# Altium schematic sheet 2403_NUCLEO64.SchDoc: STM32 NUCLEO64
size A4; Organization: R.LAB; DocumentNumber: 2403; Revision: 1; SheetNumber: 2; SheetTotal: 3
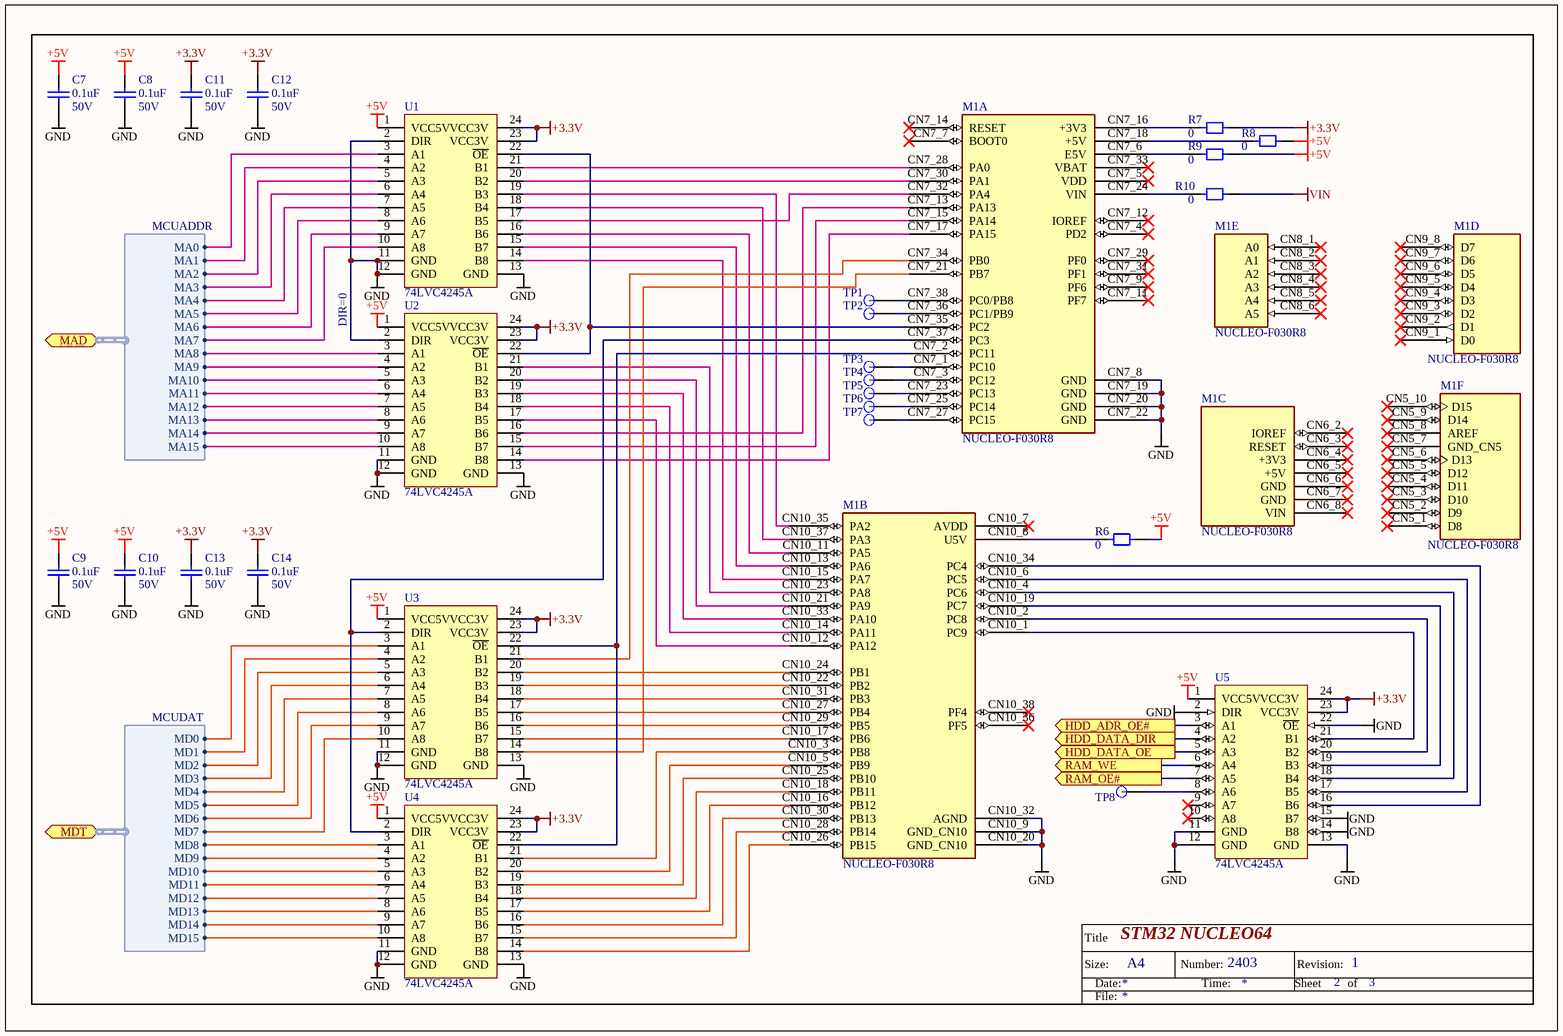
[diagram p0: 2403_NUCLEO64.SchDoc]

## Parts
C7  0.1uF  Rated Voltage: 50V  [0805_CAPC2013X100N]
C8  0.1uF  Rated Voltage: 50V  [0805_CAPC2013X100N]
C9  0.1uF  Rated Voltage: 50V  [0805_CAPC2013X100N]
C10  0.1uF  Rated Voltage: 50V  [0805_CAPC2013X100N]
C11  0.1uF  Rated Voltage: 50V  [0805_CAPC2013X100N]
C12  0.1uF  Rated Voltage: 50V  [0805_CAPC2013X100N]
C13  0.1uF  Rated Voltage: 50V  [0805_CAPC2013X100N]
C14  0.1uF  Rated Voltage: 50V  [0805_CAPC2013X100N]
M1  NUCLEO-F030R8  [MODULE_NUCLEO-F030R8]  (parts A,B,C,D,E,F of 6)
R6  0  [0805_RESC2013X84N]
R7  0  [0805_RESC2013X84N]
R8  0  [0805_RESC2013X84N]
R9  0  [0805_RESC2013X84N]
R10  0  [0805_RESC2013X84N]
TP1  TEST_POINT  [TEST2]  (value not drawn)
TP2  TEST_POINT  [TEST2]  (value not drawn)
TP3  TEST_POINT  [TEST2]  (value not drawn)
TP4  TEST_POINT  [TEST2]  (value not drawn)
TP5  TEST_POINT  [TEST2]  (value not drawn)
TP6  TEST_POINT  [TEST2]  (value not drawn)
TP7  TEST_POINT  [TEST2]  (value not drawn)
TP8  TEST_POINT  [TEST2]  (value not drawn)
U1  74LVC4245A  [SOIC127P1032X265-24N]
U2  74LVC4245A  [SOIC127P1032X265-24N]
U3  74LVC4245A  [SOIC127P1032X265-24N]
U4  74LVC4245A  [SOIC127P1032X265-24N]
U5  74LVC4245A  [SOIC127P1032X265-24N]

## Ports
HDD_ADR_OE# (out), HDD_DATA_DIR (out), HDD_DATA_OE (out), MAD (harness MCUADDR), MDT (harness MCUDAT), RAM_OE# (out), RAM_WE (out)

## Harnesses
MCUADDR: MA0, MA1, MA2, MA3, MA4, MA5, MA6, MA7, MA8, MA9, MA10, MA11, MA12, MA13, MA14, MA15
MCUDAT: MD0, MD1, MD2, MD3, MD4, MD5, MD6, MD7, MD8, MD9, MD10, MD11, MD12, MD13, MD14, MD15

## Nets
+3.3V: C11.2 C12.2 C13.2 C14.2 R7.2 U1.23(VCC3V) U1.24(VCC3V) U2.23(VCC3V) U2.24(VCC3V) U3.23(VCC3V) U3.24(VCC3V) U4.23(VCC3V) U4.24(VCC3V) U5.23(VCC3V) U5.24(VCC3V)
+5V: C7.2 C8.2 C9.2 C10.2 R6.2 R8.2 R9.2 U1.1(VCC5V) U2.1(VCC5V) U3.1(VCC5V) U4.1(VCC5V) U5.1(VCC5V)
GND: C7.1 C8.1 C9.1 C10.1 C11.1 C12.1 C13.1 C14.1 M1.CN7_8(GND) M1.CN7_19(GND) M1.CN7_20(GND) M1.CN7_22(GND) M1.CN10_9(GND_CN10) M1.CN10_20(GND_CN10) M1.CN10_32(AGND) U1.2(DIR) U1.11(GND) U1.12(GND) U1.13(GND) U2.2(DIR) U2.11(GND) U2.12(GND) U2.13(GND) U3.11(GND) U3.12(GND) U3.13(GND) U4.11(GND) U4.12(GND) U4.13(GND) U5.2(DIR) U5.11(GND) U5.12(GND) U5.13(GND) U5.14(B8) U5.15(B7) U5.22(~{OE})
VIN: R10.2
HDD_ADR_OE#: U5.3(A1) ; port HDD_ADR_OE#
HDD_DATA_DIR: U5.4(A2) ; port HDD_DATA_DIR
HDD_DATA_OE: U5.5(A3) ; port HDD_DATA_OE
RAM_OE#: U5.7(A5) ; port RAM_OE#
RAM_WE: U5.6(A4) ; port RAM_WE
NetM1_CN7_1: M1.CN7_1(PC10) TP3.1(T)
NetM1_CN7_2: M1.CN7_2(PC11) U3.22(~{OE}) U4.22(~{OE})
NetM1_CN7_3: M1.CN7_3(PC12) TP4.1(T)
NetM1_CN7_6: M1.CN7_6(E5V) R9.1
NetM1_CN7_13: M1.CN7_13(PA13) U2.16(B6)
NetM1_CN7_15: M1.CN7_15(PA14) U2.15(B7)
NetM1_CN7_16: M1.CN7_16(+3V3) R7.1
NetM1_CN7_17: M1.CN7_17(PA15) U2.14(B8)
NetM1_CN7_18: M1.CN7_18(+5V) R8.1
NetM1_CN7_21: M1.CN7_21(PB7) U3.14(B8)
NetM1_CN7_23: M1.CN7_23(PC13) TP5.1(T)
NetM1_CN7_24: M1.CN7_24(VIN) R10.1
NetM1_CN7_25: M1.CN7_25(PC14) TP6.1(T)
NetM1_CN7_27: M1.CN7_27(PC15) TP7.1(T)
NetM1_CN7_28: M1.CN7_28(PA0) U1.21(B1)
NetM1_CN7_30: M1.CN7_30(PA1) U1.20(B2)
NetM1_CN7_32: M1.CN7_32(PA4) U1.17(B5)
NetM1_CN7_34: M1.CN7_34(PB0) U3.21(B1)
NetM1_CN7_35: M1.CN7_35(PC2) U1.22(~{OE}) U2.22(~{OE})
NetM1_CN7_36: M1.CN7_36(PC1/PB9) TP2.1(T)
NetM1_CN7_37: M1.CN7_37(PC3) U3.2(DIR) U4.2(DIR)
NetM1_CN7_38: M1.CN7_38(PC0/PB8) TP1.1(T)
NetM1_CN10_1: M1.CN10_1(PC9) U5.21(B1)
NetM1_CN10_2: M1.CN10_2(PC8) U5.20(B2)
NetM1_CN10_3: M1.CN10_3(PB8) U4.21(B1)
NetM1_CN10_4: M1.CN10_4(PC6) U5.18(B4)
NetM1_CN10_5: M1.CN10_5(PB9) U4.20(B2)
NetM1_CN10_6: M1.CN10_6(PC5) U5.17(B5)
NetM1_CN10_8: M1.CN10_8(U5V) R6.1
NetM1_CN10_11: M1.CN10_11(PA5) U1.16(B6)
NetM1_CN10_12: M1.CN10_12(PA12) U2.17(B5)
NetM1_CN10_13: M1.CN10_13(PA6) U1.15(B7)
NetM1_CN10_14: M1.CN10_14(PA11) U2.18(B4)
NetM1_CN10_15: M1.CN10_15(PA7) U1.14(B8)
NetM1_CN10_16: M1.CN10_16(PB12) U4.17(B5)
NetM1_CN10_17: M1.CN10_17(PB6) U3.15(B7)
NetM1_CN10_18: M1.CN10_18(PB11) U4.18(B4)
NetM1_CN10_19: M1.CN10_19(PC7) U5.19(B3)
NetM1_CN10_21: M1.CN10_21(PA9) U2.20(B2)
NetM1_CN10_22: M1.CN10_22(PB2) U3.19(B3)
NetM1_CN10_23: M1.CN10_23(PA8) U2.21(B1)
NetM1_CN10_24: M1.CN10_24(PB1) U3.20(B2)
NetM1_CN10_25: M1.CN10_25(PB10) U4.19(B3)
NetM1_CN10_26: M1.CN10_26(PB15) U4.14(B8)
NetM1_CN10_27: M1.CN10_27(PB4) U3.17(B5)
NetM1_CN10_28: M1.CN10_28(PB14) U4.15(B7)
NetM1_CN10_29: M1.CN10_29(PB5) U3.16(B6)
NetM1_CN10_30: M1.CN10_30(PB13) U4.16(B6)
NetM1_CN10_31: M1.CN10_31(PB3) U3.18(B4)
NetM1_CN10_33: M1.CN10_33(PA10) U2.19(B3)
NetM1_CN10_34: M1.CN10_34(PC4) U5.16(B6)
NetM1_CN10_35: M1.CN10_35(PA2) U1.19(B3)
NetM1_CN10_37: M1.CN10_37(PA3) U1.18(B4)
NetTP8_1: TP8.1(T) U5.8(A6)
NetU1_3: U1.3(A1) ; port MAD.MA0
NetU1_4: U1.4(A2) ; port MAD.MA1
NetU1_5: U1.5(A3) ; port MAD.MA2
NetU1_6: U1.6(A4) ; port MAD.MA3
NetU1_7: U1.7(A5) ; port MAD.MA4
NetU1_8: U1.8(A6) ; port MAD.MA5
NetU1_9: U1.9(A7) ; port MAD.MA6
NetU1_10: U1.10(A8) ; port MAD.MA7
NetU2_3: U2.3(A1) ; port MAD.MA8
NetU2_4: U2.4(A2) ; port MAD.MA9
NetU2_5: U2.5(A3) ; port MAD.MA10
NetU2_6: U2.6(A4) ; port MAD.MA11
NetU2_7: U2.7(A5) ; port MAD.MA12
NetU2_8: U2.8(A6) ; port MAD.MA13
NetU2_9: U2.9(A7) ; port MAD.MA14
NetU2_10: U2.10(A8) ; port MAD.MA15
NetU3_3: U3.3(A1) ; port MDT.MD0
NetU3_4: U3.4(A2) ; port MDT.MD1
NetU3_5: U3.5(A3) ; port MDT.MD2
NetU3_6: U3.6(A4) ; port MDT.MD3
NetU3_7: U3.7(A5) ; port MDT.MD4
NetU3_8: U3.8(A6) ; port MDT.MD5
NetU3_9: U3.9(A7) ; port MDT.MD6
NetU3_10: U3.10(A8) ; port MDT.MD7
NetU4_3: U4.3(A1) ; port MDT.MD8
NetU4_4: U4.4(A2) ; port MDT.MD9
NetU4_5: U4.5(A3) ; port MDT.MD10
NetU4_6: U4.6(A4) ; port MDT.MD11
NetU4_7: U4.7(A5) ; port MDT.MD12
NetU4_8: U4.8(A6) ; port MDT.MD13
NetU4_9: U4.9(A7) ; port MDT.MD14
NetU4_10: U4.10(A8) ; port MDT.MD15

Not connected (* = marked no-connect by the designer): M1 CN5_1(D8)* CN5_2(D9)* CN5_3(D10)* CN5_4(D11)* CN5_5(D12)* CN5_6(D13)* CN5_7(GND_CN5)* CN5_8(AREF)* CN5_9(D14)* CN5_10(D15)* CN6_2(IOREF)* CN6_3(RESET)* CN6_4(+3V3)* CN6_5(+5V)* CN6_6(GND)* CN6_7(GND)* CN6_8(VIN)* CN7_4(PD2)* CN7_5(VDD)* CN7_7(BOOT0)* CN7_9(PF6)* CN7_11(PF7)* CN7_12(IOREF)* CN7_14(RESET)* CN7_29(PF0)* CN7_31(PF1)* CN7_33(VBAT)* CN8_1(A0)* CN8_2(A1)* CN8_3(A2)* CN8_4(A3)* CN8_5(A4)* CN8_6(A5)* CN9_1(D0)* CN9_2(D1)* CN9_3(D2)* CN9_4(D3)* CN9_5(D4)* CN9_6(D5)* CN9_7(D6)* CN9_8(D7)* CN10_7(AVDD)* CN10_36(PF5)* CN10_38(PF4)*; U5 9(A7)* 10(A8)*

## Notes on the sheet
- DIR=0
- Title
- Size:
- Date:
- A4
- Number:
- Time:
- Sheet
- Revision:
- of
- File:

## Library data of the parts
C7-C14 = Cap SMD: Capacitor SMD; Suppler: chips; VALUE: 0.1uF; PackageReference: 0805; Publisher: SY; Price: 1
M1 = NUCLEO-F030R8: STM32F030R8, mbed-Enabled Development Nucleo-64 STM32F0 ARM® Cortex®-M0 MCU 32-Bit Embedded Evaluation Board; MF: STMicroelectronics; Package: TSOT-23 STMicroelectronics; Price: None; SnapEDA_Link: https://www.snapeda.com/parts/NUCLEO-F030R8/STMicroelectronics/view-part/240805/?ref=snap; Availability: Unavailable; Value: *; MP: NUCLEO-F030R8; Publisher: SY
R6-R10 = Resistor SMD L: SMD Resistor; Tolerance: 5%; Power: 0.1W; VALUE: 0; Publisher: SY; Price: *; Suppler: *; Package: 0805
TP1-TP8 = TEST_POINT: Test point; Publisher: SY
U1-U5 = 74LVC4245A: Octal Bus Transceiver and 3.3-V to 5-V Shifter / With 3-State Outputs; Suppler: ChipDip; Publisher: SY; Source: Renishaw MP12; Price: ?